# Altium project Icarus Som.PrjPcb
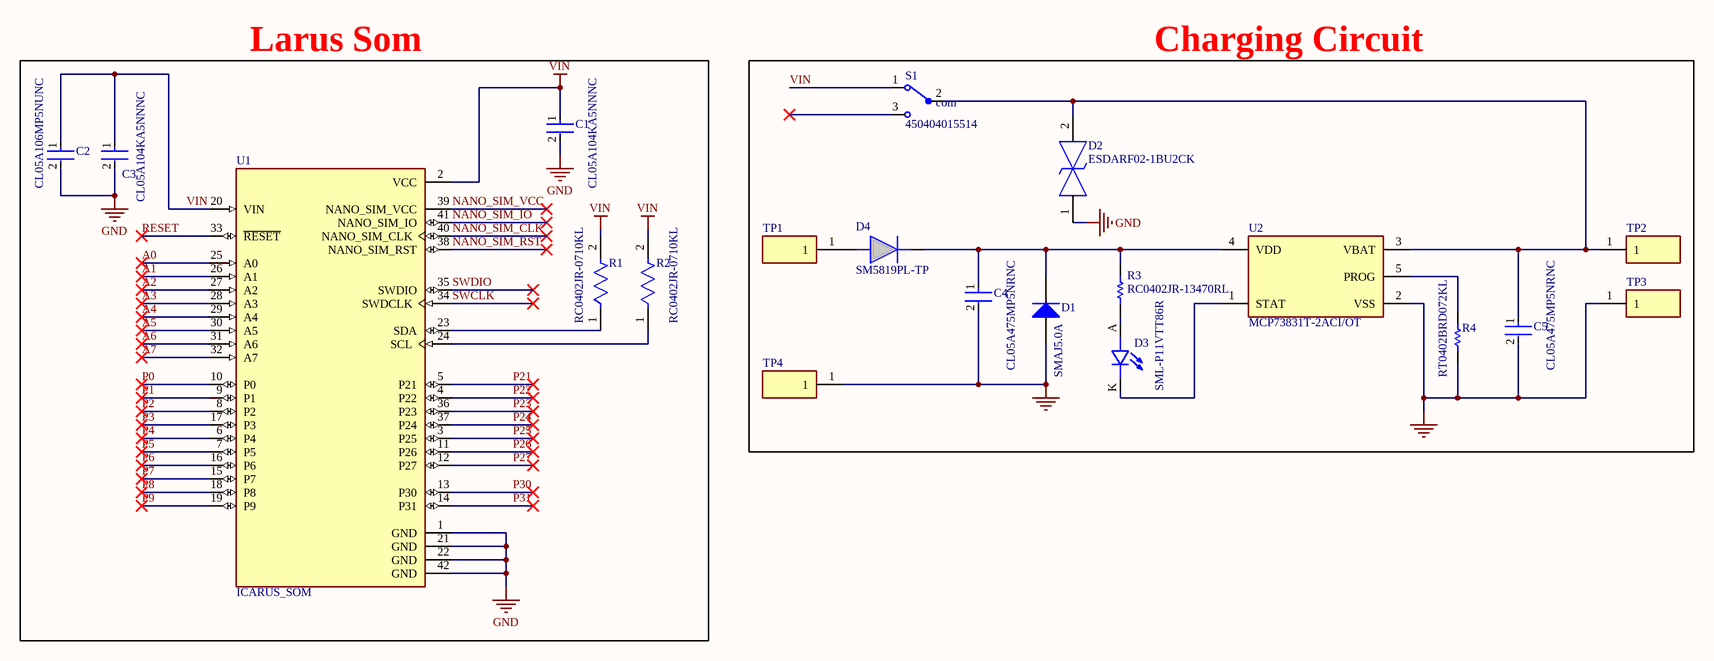
[diagram p0: Icarus Som.SchDoc]
1 sheet, 20 parts. Net scope: global (net labels, ports and power ports of the same name join across sheets).
Board file: lcarus Som.PcbDoc

## Sheet Icarus Som.SchDoc
size A3; SheetNumber: 1; SheetTotal: 1

### Parts
C1  CL05A104KA5NNNC  [FP-CL278-IPC_A]
C2  CL05A106MP5NUNC  [FP-CL05A106MP5NUNC-MFG]
C3  CL05A104KA5NNNC  [FP-CL278-IPC_A]
C4  CL05A475MP5NRNC  [FP-CL282-IPC_A]
C5  CL05A475MP5NRNC  [FP-CL282-IPC_A]
D1  SMAJ5.0A  [BOUR-SMA-2_V]
D2  ESDARF02-1BU2CK  [ESDARF021BU2CK]
D3  SML-P11VTT86R  [LED_SML-P11VTT86R]
D4  SM5819PL-TP  [SODFL3716X120N]
R1  RC0402JR-0710KL  [FP-RC0402-0_4-IPC_A]
R2  RC0402JR-0710KL  [FP-RC0402-0_4-IPC_A]
R3  RC0402JR-13470RL  [RESC1005X40X25LL05T10]
R4  RT0402BRD072KL  [RESC1005X35X25LL10T10]
S1  450404015514  [450404015514]
TP1  (no value)  [TP+195X110]
TP2  (no value)  [TP+195X110]
TP3  (no value)  [TP+195X110]
TP4  (no value)  [TP+195X110]
U1  ICARUS_SOM  [MODULE_ICARUS_SOM]
U2  MCP73831T-2ACI/OT  [FP-C04-091-OT-IPC_A]

### Blocks framed on the sheet
Larus Som: C1-C3 R1 R2 U1
Charging Circuit: C4 C5 D1-D4 R3 R4 S1 TP1-TP4 U2

### Nets
GND: C1.2 C2.2 C3.2 C4.2 C5.2 D1.1(A) D2.1 R4.1 TP3.1 TP4.1 U1.1(GND) U1.21(GND) U1.22(GND) U1.42(GND) U2.2(VSS)
VIN: C1.1 C2.1 C3.1 R1.2 R2.2 S1.1 U1.2(VCC) U1.20(VIN)
A0: U1.25(A0)
A1: U1.26(A1)
A2: U1.27(A2)
A3: U1.28(A3)
A4: U1.29(A4)
A5: U1.30(A5)
A6: U1.31(A6)
A7: U1.32(A7)
NANO_SIM_CLK: U1.40(NANO_SIM_CLK)
NANO_SIM_IO: U1.41(NANO_SIM_IO)
NANO_SIM_RST: U1.38(NANO_SIM_RST)
NANO_SIM_VCC: U1.39(NANO_SIM_VCC)
P0: U1.10(P0)
P1: U1.9(P1)
P2: U1.8(P2)
P3: U1.17(P3)
P4: U1.6(P4)
P5: U1.7(P5)
P6: U1.16(P6)
P7: U1.15(P7)
P8: U1.18(P8)
P9: U1.19(P9)
P21: U1.5(P21)
P22: U1.4(P22)
P23: U1.36(P23)
P24: U1.37(P24)
P25: U1.3(P25)
P26: U1.11(P26)
P27: U1.12(P27)
P30: U1.13(P30)
P31: U1.14(P31)
RESET: U1.33(~{RESET})
SWCLK: U1.34(SWDCLK)
SWDIO: U1.35(SWDIO)
NetC4_1: C4.1 D1.2(K) D4.1(K) R3.2 U2.4(VDD)
NetC5_1: C5.1 D2.2 S1.2 TP2.1 U2.3(VBAT)
NetD3_A: D3.A R3.1
NetD3_K: D3.K U2.1(STAT)
NetD4_2: D4.2(A) TP1.1
NetR1_1: R1.1 U1.23(SDA)
NetR2_1: R2.1 U1.24(SCL)
NetR4_2: R4.2 U2.5(PROG)

Not connected (* = marked no-connect by the designer): S1 3*

### Notes on the sheet
- (in symbol 450404015514) com

### Library data of the parts
C1 C3 = CMP-13271-000728-1: Cap Ceramic 100nF 25V X5R ±10% SMD 0402 +85°C Paper T/R; Package Quantity: 1; Height: 0.5mm; Case Code (Metric): 1005; Thickness: 0.022inch; Mount: Surface Mount; Lead Free: Lead Free; Case Code (Imperial): 0402; Packaging: Tape and Reel; Depth: 0.5mm; Voltage: 25V; Min Operating Temperature: -55°C; Voltage Rating: 25V; Dielectric: X5R; Case/Package: 0402; Tolerance: 10%; Width: 0.02inch; Max Operating Temperature: 85°C; Capacitance: 100nF; Length: 1mm; Radiation Hardening: No; Voltage Rating (DC): 25V
C2 = CMP-13271-000002-1: CAP CER 10UF 10V X5R 0402; Manufacturer: Samsung; Temperature Coefficient: 15%; Tolerance: 20%; Material: Ceramic; Octopart: https://octopart.com/cl05a106mp5nunc-samsung-22457395; Voltage Rating: 10V; RoHS: TRUE; Value: 10uF; Height: 0.7mm; Digikey Description: CAP CER 10UF 10V X5R 0402; Automotive: No; Package: CL05A106MP5NUNC; Device Class L1: Passive Components; Capacitance: 10uF; Temperature Range High: +85°C; ComponentLink2Description: Datasheet; Device Class L2: Capacitors; Temperature Characteristic: X5R; Manufacturer Part Number: CL05A106MP5NUNC; Temperature: -55°C to +85°C; ComponentLink2URL: http://www.samsungsem.com/kr/support/product-search/mlcc/__icsFiles/afieldfile/2019/05/10/19-CL05A106MP5NUNC.pdf; Device Class L3: Ceramic Capacitors; Category: Cap; Temperature Range Low: -55°C; Ipc Land Pattern Name: CAPC10050X50; Lead Free: Yes
C4 C5 = CMP-13271-000548-1: Cap Ceramic 4.7uF 10V X5R ±20% SMD 0402 +85°C Paper T/R; Capacitance: 4.7uF; Max Operating Temperature: 85°C; Lead Free: Lead Free; Tolerance: 20%; Voltage Rating: 10V; Dielectric: X5R; Width: 0.02inch; Length: 0.039inch; Case/Package: 0402; Min Operating Temperature: -55°C; Packaging: Tape and Reel; Thickness: 0.022inch; Case Code (Imperial): 0402; Package Quantity: 10000; Case Code (Metric): 1005; Mount: Surface Mount
D1 = CMP-2000-07090-1: SMAJ Transient Voltage Suppressor Diode Series, 3.5 V, -55 to 150 degC, 2-Pin SMA, RoHS, Tape and Reel; Manufacturer: Bourns; EDA / CAD Models: DownloadfromAcceleratedDesigns; Unidirectional Channels: 1; Voltage - Breakdown (Min): 6.4V; Voltage - Reverse Standoff (Typ): 5V; Voltage - Clamping (Max) @ Ipp: 9.2V; Other Names: SMAJ5.0ABDKR; Type: Zener; Catalog Drawings: SMAJSeriesFootprintSMAJ,SMBJSeries; Featured Product: SMAJ/SMBJ/SMCJ/SMLJDiscreteTVSDiodes; Power - Peak Pulse: 400W; Current - Peak Pulse (10/1000µs): 43.5A; Power Line Protection: No; Online Catalog: SMAJSeries; Supplier Device Package: SMA(DO-214AC); Operating Temperature: -55°C~150°C(TJ); Package Description: 2-Pin Surface Mount Device, Body 4.315 x 2.605 mm; Datasheet URL: https://datasheet.ciiva.com/25624/0900766b8112213b-25624680.pdf; Manufacturer URL: http://www.bourns.com/; Datasheet Version: 08/2012; Series: SMAJ; Family: TVS-Diodes; Bidirectional Channels: -; Applications: GeneralPurpose; Package Reference: SMA-2; Standard Package: 1; Package / Case: DO-214AC,SMA; Category: CircuitProtection; RoHS Information: SMAJSeriesMaterialDeclaration; Mounting Technology: SurfaceMount; Capacitance @ Frequency: -; Packaging: Digi-Reel®; Mounting Type: SurfaceMount
D2 = ESDARF02-1BU2CK: STMicroelectronics ESDARF02-1BU2CK Bi-Directional ESD Protection Diode, 20W peak, 2-Pin ST-0201; Geometry.Height: 0.33mm; Mouser Part Number: 511-ESDARF02-1BU2CK; Mouser Price/Stock: https://www.mouser.co.uk/ProductDetail/STMicroelectronics/ESDARF02-1BU2CK?qs=Ng9CY5lTJpiKVTbvT0A0SQ%3D%3D; Manufacturer_Name: STMicroelectronics; Manufacturer_Part_Number: ESDARF02-1BU2CK; Datasheet Link: https://www.st.com/resource/en/datasheet/esdarf02-1bu2ck.pdf
D3 = SML-P11VTT86R: Red 626nm LED Indication - Discrete 1.8V 0402 (1006 Metric); MF: Rohm; Purchase-URL: https://pricing.snapeda.com/search?q=SML-P11VTT86R&ref=eda; Package: 0402 Rohm; Check_prices: https://www.snapeda.com/parts/SML-P11VTT86R/Rohm/view-part/?ref=eda; Value: *; SnapEDA_Link: https://www.snapeda.com/parts/SML-P11VTT86R/Rohm/view-part/?ref=snap; MP: SML-P11VTT86R; Digi-Key_Part_Number: 846-SML-P11VTT86RTR-ND
D4 = SM5819PL-TP: Schottky Barrier Rectifiers; Manufacturer_Name: MCC; Geometry.Height: 1.2mm; Mouser Part Number: 833-SM5819PL-TP; Mouser Price/Stock: https://www.mouser.co.uk/ProductDetail/Micro-Commercial-Components-MCC/SM5819PL-TP?qs=SdqRYZZ9IxAC1pyGL%2FvLRg%3D%3D; Manufacturer_Part_Number: SM5819PL-TP; Datasheet Link: https://mccsemi.com/pdf/Products/SM5817PL-SM5819PL(SOD-123FL).pdf
R1 R2 = CMP-2002-07915-3: RES 10K OHM 5% 1/16W 0402; Max Power Dissipation: 63mW; Temperature Coefficient: 100ppm/°C; Power Rating: 62.5mW; Resistance: 10kR; Voltage Rating: 50V; Size Code: 0402; Resistance Tolerance: 5%; Packaging: Tape and Reel; Case Code (Metric): 1005; Lead Free: Lead Free; Resistor Type: Thick Film; Min Operating Temperature: -55°C; Military Standard: Not; Depth: 0.5mm; Series: RC; Case/Package: 0402; Construction: Rectangular; Number of Terminations: 2; Package Quantity: 1; Termination: SMD/SMT; Length: 0.039inch; Case Code (Imperial): 0402; Height: 0.016inch; Features: Moisture Resistant; RoHS Compliant: Yes; Max Operating Temperature: 155°C; Tolerance: 5%; Width: 0.02inch
R3 = CMP-2002-08087-1: RES 470R; Manufacturer: Yageo; Part Number: RC0402JR-13470RL
R4 = CMP-2002-02941-1: RES 2K; Manufacturer: Yageo; Part Number: RT0402BRD072KL
S1 = 450404015514: MINI SLIDE SWITCH 6.7 X 2.7 MM.; MF: WÃ¼rth Elektronik; Package: None; Price: None; Check_prices: https://www.snapeda.com/parts/450404015514/Wurth+Elektronik/view-part/?ref=eda; Value: *; SnapEDA_Link: https://www.snapeda.com/parts/450404015514/Wurth+Elektronik/view-part/?ref=snap; MP: 450404015514; Availability: In Stock; Purchase-URL: https://pricing.snapeda.com/search/part/450404015514/?ref=eda
TP1-TP4 = RCU-0C: Natural PC Test Point - - Plating Surface Mount Mounting Type; MF: TE Connectivity AMP Connectors; Package: None; Value: *; Purchase-URL: https://pricing.snapeda.com/search/part/RCU-0C/?ref=eda; Availability: In Stock; MP: RCU-0C; Check_prices: https://www.snapeda.com/parts/RCU-0C/TE+Connectivity/view-part/?ref=eda; SnapEDA_Link: https://www.snapeda.com/parts/RCU-0C/TE+Connectivity/view-part/?ref=snap; Price: None
U1 = ICARUS_SOM: Module for IoT connectivity. Includes global LTE-M & NB-IoT, GPS, Accelerometer as well as an eSIM for connectivity out of the box.; MP: Icarus SOM; MF: Actinius; Price: None; Availability: Not in stock; Value: *; Package: None
U2 = CMP-0133-00143-2: IC CONTROLLR LI-ION 4.2V SOT23-5; Max Power Dissipation: 1.54W; Output Current: 500mA; Max Output Voltage: 4.5V; Number of Outputs: 1; Min Output Voltage: 4.168V; Min Supply Voltage: 3.75V; Max Input Voltage: 6V; Voltage Rating: 4.534V; Drain to Source Resistance: 350mR; Max Operating Temperature: 85°C; Length: 0.122inch; Number of Pins: 5; REACH SVHC: No SVHC; Radiation Hardening: No; Min Operating Temperature: -40°C; Weight: 0.00709oz; Contact Plating: Tin; Termination: SMD/SMT; Case/Package: SOT-23; Mount: Surface Mount; Width: 0.071inch; Packaging: Tape and Reel; Number of Cells: 1; Max Charge Current: 500mA; Height: 0.051inch; Number of Channels: 1; Output Voltage: 4.2V; Max Supply Voltage: 6V; Lead Free: Lead Free